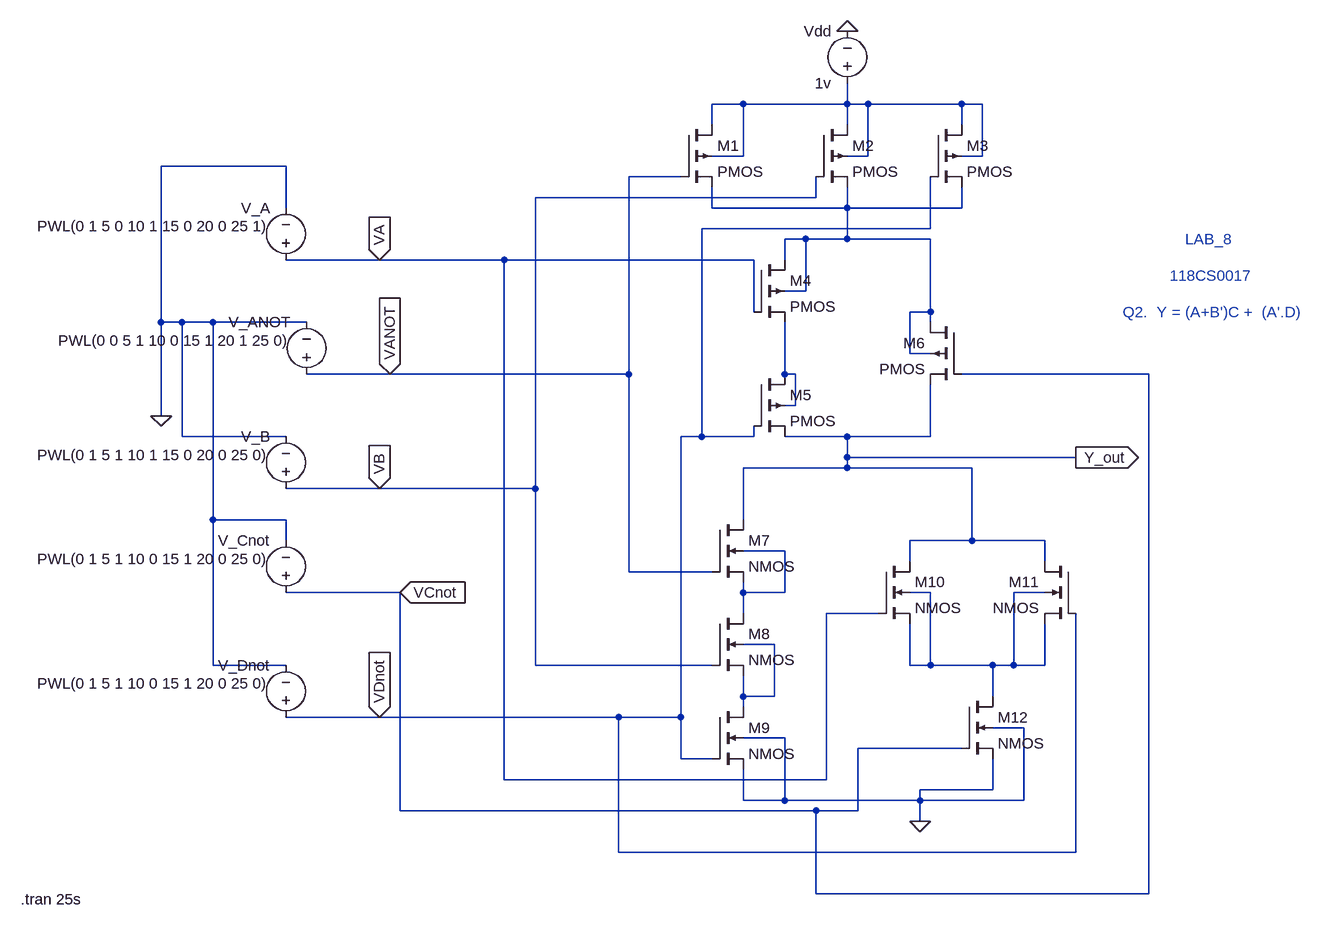
[diagram p0: schematic Draft18.asc]
Draft18.asc, the LTspice schematic file:
Version 4
SHEET 1 984 1256
WIRE 96 16 48 16
WIRE 256 16 256 -16
WIRE 256 16 96 16
WIRE 288 16 256 16
WIRE 432 16 288 16
WIRE 464 16 432 16
WIRE 48 48 48 16
WIRE 256 48 256 16
WIRE 432 48 432 16
WIRE 96 96 96 16
WIRE 96 96 48 96
WIRE 288 96 288 16
WIRE 288 96 256 96
WIRE 464 96 464 16
WIRE 464 96 432 96
WIRE -608 112 -800 112
WIRE 0 128 -80 128
WIRE 208 160 208 128
WIRE 208 160 -224 160
WIRE -608 176 -608 112
WIRE 48 176 48 144
WIRE 256 176 256 144
WIRE 256 176 48 176
WIRE 432 176 432 144
WIRE 432 176 256 176
WIRE 384 208 384 128
WIRE 384 208 32 208
WIRE 192 224 160 224
WIRE 256 224 256 176
WIRE 256 224 192 224
WIRE 384 224 256 224
WIRE -464 256 -608 256
WIRE -272 256 -464 256
WIRE 112 256 -272 256
WIRE 160 256 160 224
WIRE 192 304 192 224
WIRE 192 304 160 304
WIRE 112 336 112 256
WIRE 384 336 384 224
WIRE 384 336 352 336
WIRE -800 352 -800 112
WIRE -768 352 -800 352
WIRE -720 352 -768 352
WIRE -576 352 -720 352
WIRE 384 352 384 336
WIRE 352 400 352 336
WIRE 384 400 352 400
WIRE -448 432 -576 432
WIRE -80 432 -80 128
WIRE -80 432 -448 432
WIRE 160 432 160 352
WIRE 176 432 160 432
WIRE 720 432 432 432
WIRE 176 480 176 432
WIRE 176 480 160 480
WIRE -800 496 -800 352
WIRE -768 528 -768 352
WIRE -608 528 -768 528
WIRE 32 528 32 208
WIRE 32 528 0 528
WIRE 112 528 112 512
WIRE 112 528 32 528
WIRE 256 528 160 528
WIRE 384 528 384 448
WIRE 384 528 256 528
WIRE 256 560 256 528
WIRE 608 560 256 560
WIRE 256 576 256 560
WIRE 256 576 96 576
WIRE 448 576 256 576
WIRE -464 608 -608 608
WIRE -224 608 -224 160
WIRE -224 608 -464 608
WIRE -720 656 -720 352
WIRE -608 656 -720 656
WIRE 96 656 96 576
WIRE -608 688 -608 656
WIRE 448 688 448 576
WIRE 448 688 352 688
WIRE 560 688 448 688
WIRE 160 704 96 704
WIRE 352 720 352 688
WIRE 560 720 560 688
WIRE -80 736 -80 432
WIRE 48 736 -80 736
WIRE -432 768 -608 768
WIRE 96 768 96 752
WIRE 160 768 160 704
WIRE 160 768 96 768
WIRE 384 768 352 768
WIRE 560 768 512 768
WIRE 96 800 96 768
WIRE 304 800 224 800
WIRE 144 848 96 848
WIRE -720 880 -720 656
WIRE -608 880 -720 880
WIRE -224 880 -224 608
WIRE 48 880 -224 880
WIRE 352 880 352 816
WIRE 384 880 384 768
WIRE 384 880 352 880
WIRE 480 880 384 880
WIRE 512 880 512 768
WIRE 512 880 480 880
WIRE 560 880 560 816
WIRE 560 880 512 880
WIRE 96 928 96 896
WIRE 144 928 144 848
WIRE 144 928 96 928
WIRE 480 928 480 880
WIRE 96 944 96 928
WIRE -464 960 -608 960
WIRE -96 960 -464 960
WIRE 0 960 0 528
WIRE 0 960 -96 960
WIRE 528 976 480 976
WIRE 160 992 96 992
WIRE 432 1008 272 1008
WIRE 0 1024 0 960
WIRE 48 1024 0 1024
WIRE -272 1056 -272 256
WIRE 224 1056 224 800
WIRE 224 1056 -272 1056
WIRE 480 1072 480 1024
WIRE 480 1072 368 1072
WIRE 96 1088 96 1040
WIRE 160 1088 160 992
WIRE 160 1088 96 1088
WIRE 368 1088 368 1072
WIRE 368 1088 160 1088
WIRE 528 1088 528 976
WIRE 528 1088 368 1088
WIRE -432 1104 -432 768
WIRE 208 1104 -432 1104
WIRE 272 1104 272 1008
WIRE 272 1104 208 1104
WIRE 368 1120 368 1088
WIRE -96 1168 -96 960
WIRE 608 1168 608 800
WIRE 608 1168 -96 1168
WIRE 208 1232 208 1104
WIRE 720 1232 720 432
WIRE 720 1232 208 1232
FLAG 256 -96 0
FLAG 368 1120 0
FLAG 608 560 Y_out
IOPIN 608 560 Out
FLAG -800 496 0
FLAG -464 256 VA
IOPIN -464 256 In
FLAG -448 432 VANOT
IOPIN -448 432 In
FLAG -464 608 VB
IOPIN -464 608 In
FLAG -432 768 VCnot
IOPIN -432 768 In
FLAG -464 960 VDnot
IOPIN -464 960 In
SYMBOL pmos4 0 48 R0
SYMATTR InstName M1
SYMBOL pmos4 208 48 R0
SYMATTR InstName M2
SYMBOL pmos4 384 48 R0
SYMATTR InstName M3
SYMBOL pmos4 112 256 R0
SYMATTR InstName M4
SYMBOL pmos4 112 432 R0
SYMATTR InstName M5
SYMBOL pmos4 432 352 M0
SYMATTR InstName M6
SYMBOL voltage 256 0 R180
WINDOW 0 24 96 Left 2
WINDOW 3 24 16 Left 2
SYMATTR InstName Vdd
SYMATTR Value 1v
SYMBOL nmos4 48 656 R0
SYMATTR InstName M7
SYMBOL nmos4 48 800 R0
SYMATTR InstName M8
SYMBOL nmos4 48 944 R0
SYMATTR InstName M9
SYMBOL nmos4 304 720 R0
SYMATTR InstName M10
SYMBOL nmos4 608 720 M0
SYMATTR InstName M11
SYMBOL nmos4 432 928 R0
SYMATTR InstName M12
SYMBOL voltage -608 976 R180
WINDOW 0 24 96 Left 2
WINDOW 3 24 68 Left 2
WINDOW 123 0 0 Left 0
WINDOW 39 0 0 Left 0
SYMATTR InstName V_Dnot
SYMATTR Value PWL(0 1 5 1 10 0 15 1 20 0 25 0)
SYMBOL voltage -608 784 R180
WINDOW 0 24 96 Left 2
WINDOW 3 24 68 Left 2
WINDOW 123 0 0 Left 0
WINDOW 39 0 0 Left 0
SYMATTR InstName V_Cnot
SYMATTR Value PWL(0 1 5 1 10 0 15 1 20 0 25 0)
SYMBOL voltage -608 624 R180
WINDOW 0 24 96 Left 2
WINDOW 3 24 68 Left 2
WINDOW 123 0 0 Left 0
WINDOW 39 0 0 Left 0
SYMATTR InstName V_B
SYMATTR Value PWL(0 1 5 1 10 1 15 0 20 0 25 0)
SYMBOL voltage -576 448 R180
WINDOW 0 24 96 Left 2
WINDOW 3 24 68 Left 2
WINDOW 123 0 0 Left 0
WINDOW 39 0 0 Left 0
SYMATTR InstName V_ANOT
SYMATTR Value PWL(0 0 5 1 10 0 15 1 20 1 25 0)
SYMBOL voltage -608 272 R180
WINDOW 0 24 96 Left 2
WINDOW 3 24 68 Left 2
WINDOW 123 0 0 Left 0
WINDOW 39 0 0 Left 0
SYMATTR InstName V_A
SYMATTR Value PWL(0 1 5 0 10 1 15 0 20 0 25 1)
TEXT -1016 1240 Left 2 !.tran 25s
TEXT 752 280 Left 2 ;118CS0017
TEXT 776 224 Left 2 ;LAB_8
TEXT 680 336 Left 2 ;Q2.  Y = (A+B')C +  (A'.D)

The netlist it stands for:
* Draft18.asc
M1 N001 VANOT N002 N001 PMOS
M2 N001 VB N002 N001 PMOS
M3 N001 VDnot N002 N001 PMOS
M4 N002 VA N003 N002 PMOS
M5 N003 VDnot Y_out N003 PMOS
M6 N002 VCnot Y_out N002 PMOS
Vdd N001 0 1v
M7 Y_out VANOT N004 N004 NMOS
M8 N004 VB N006 N006 NMOS
M9 N006 VDnot 0 0 NMOS
M10 Y_out VA N005 N005 NMOS
M11 Y_out VDnot N005 N005 NMOS
M12 N005 VCnot 0 0 NMOS
V_Dnot VDnot 0 PWL(0 1 5 1 10 0 15 1 20 0 25 0)
V_Cnot VCnot 0 PWL(0 1 5 1 10 0 15 1 20 0 25 0)
V_B VB 0 PWL(0 1 5 1 10 1 15 0 20 0 25 0)
V_ANOT VANOT 0 PWL(0 0 5 1 10 0 15 1 20 1 25 0)
V_A VA 0 PWL(0 1 5 0 10 1 15 0 20 0 25 1)
.model NMOS NMOS
.model PMOS PMOS
.lib standard.mos
.tran 25s
* 118CS0017
* LAB_8
* Q2.  Y = (A+B')C +  (A'.D)
.backanno
.end